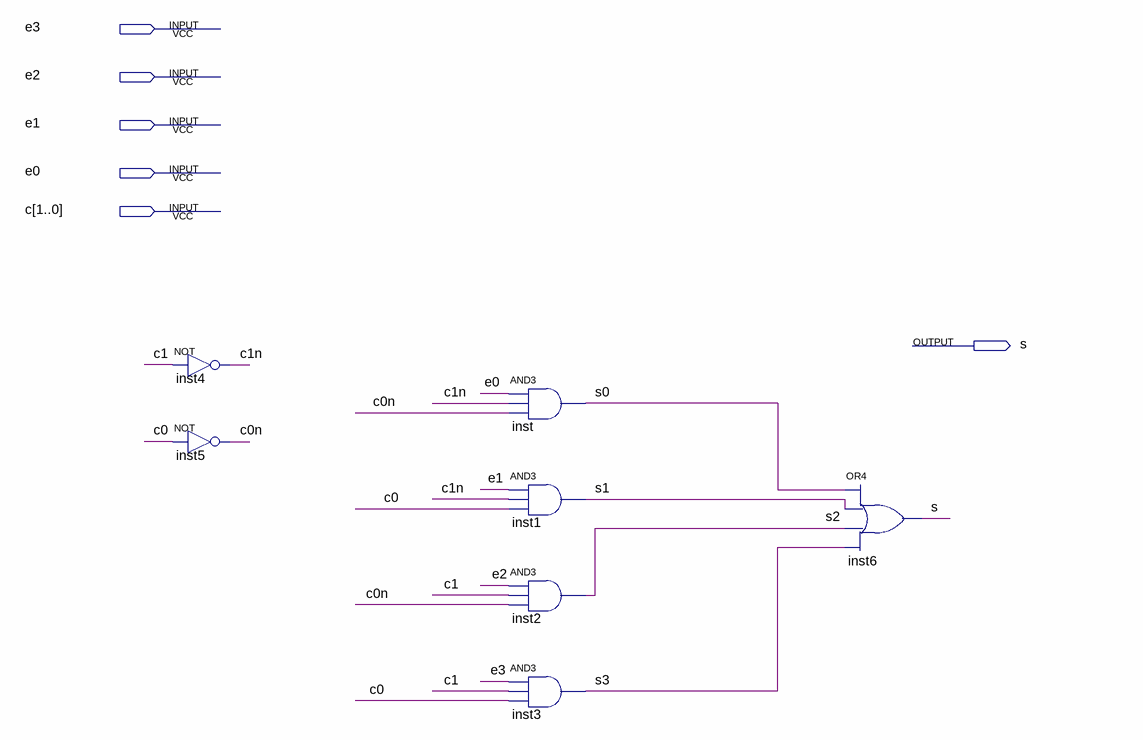
[diagram p0: schematic sheet]
// Quartus schematic abk_mux4x1.bdf as structural Verilog: 7 symbols, 6 pins
module abk_mux4x1 (
  input  e3,
  input  e2,
  input  e1,
  input  e0,
  input  [1:0] c,
  output s
);

  wire c0n, c1n, s0, s1, s2, s3;

  not inst4 (c1n, c[1]);
  not inst5 (c0n, c[0]);
  and inst (s0, e0, c1n, c0n);
  and inst1 (s1, e1, c1n, c[0]);
  and inst2 (s2, e2, c[1], c0n);
  and inst3 (s3, e3, c[1], c[0]);
  or inst6 (s, s0, s1, s2, s3);
endmodule
